# EAGLE schematic PhotoVideoFrame (EAGLE 9.6.2)

## Sheet 1 of 2
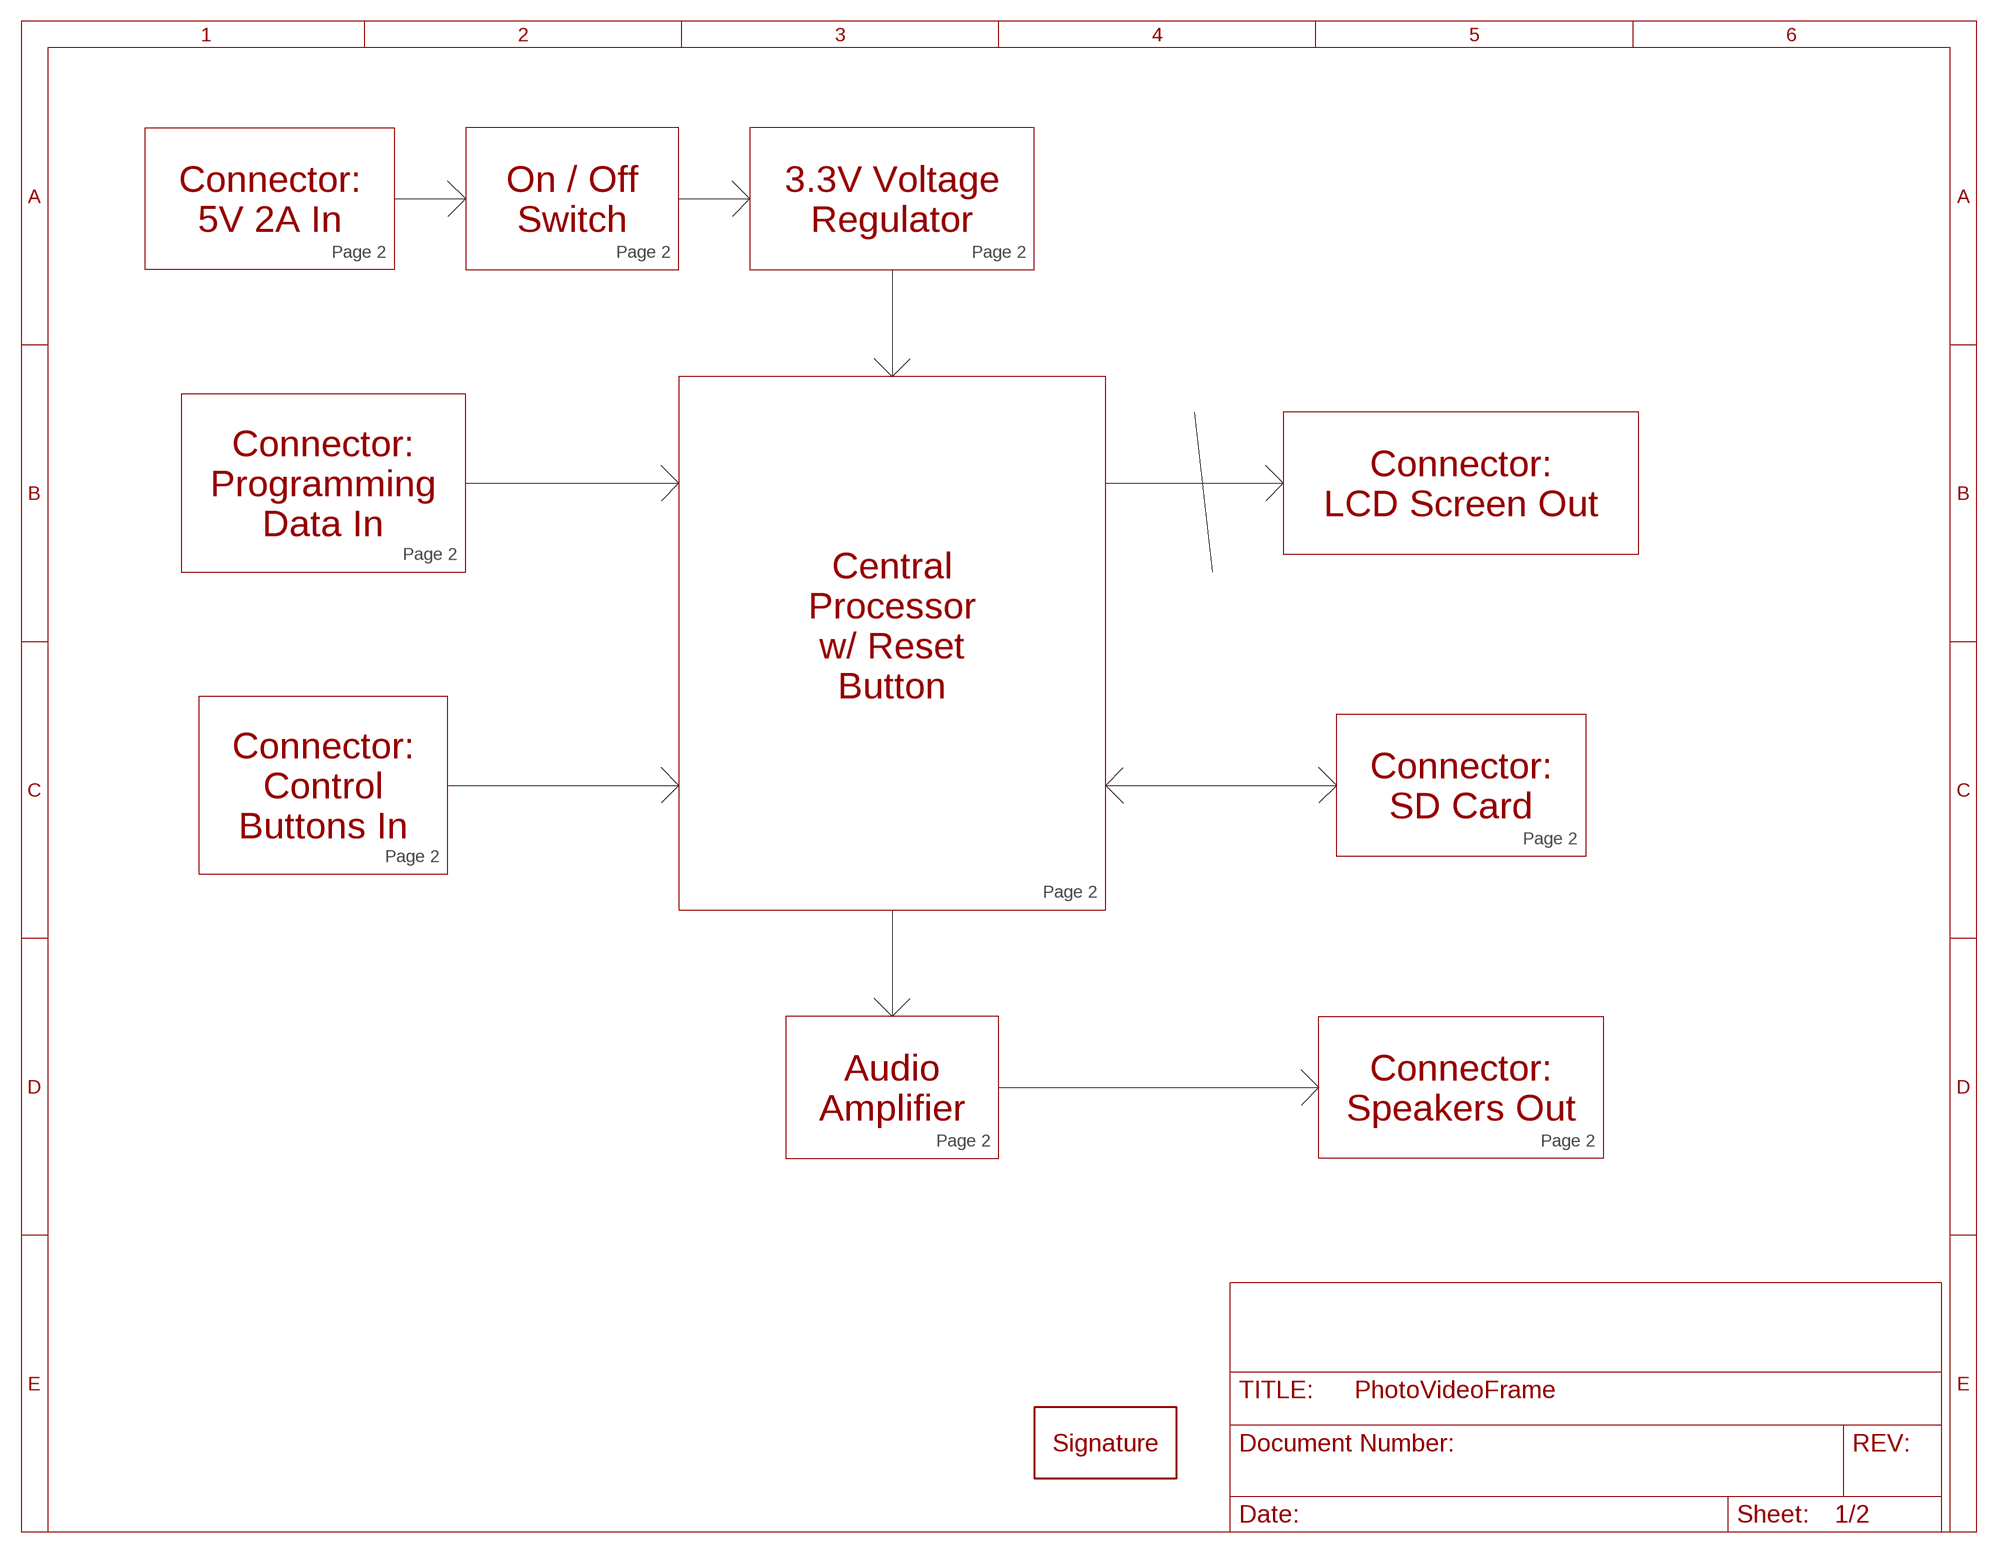
[diagram p0: schematic, sheet 1]

### Parts
U$1  SIGNATURE  [SIGNATURE]

### Notes on the sheet
- Connector:
  5V 2A In
- On / Off
  Switch
- 3.3V Voltage
  Regulator
- Page 2 | Page 2 | Page 2
- Connector:
  Programming
  Data In
- Connector:
  LCD Screen Out
- Page 2
- Central
  Processor
  w/ Reset
  Button
- Connector:
  Control
  Buttons In
- Connector:
  SD Card
- Page 2
- Page 2
- Page 2
- Audio
  Amplifier
- Connector:
  Speakers Out
- Page 2 | Page 2

## Sheet 2 of 2
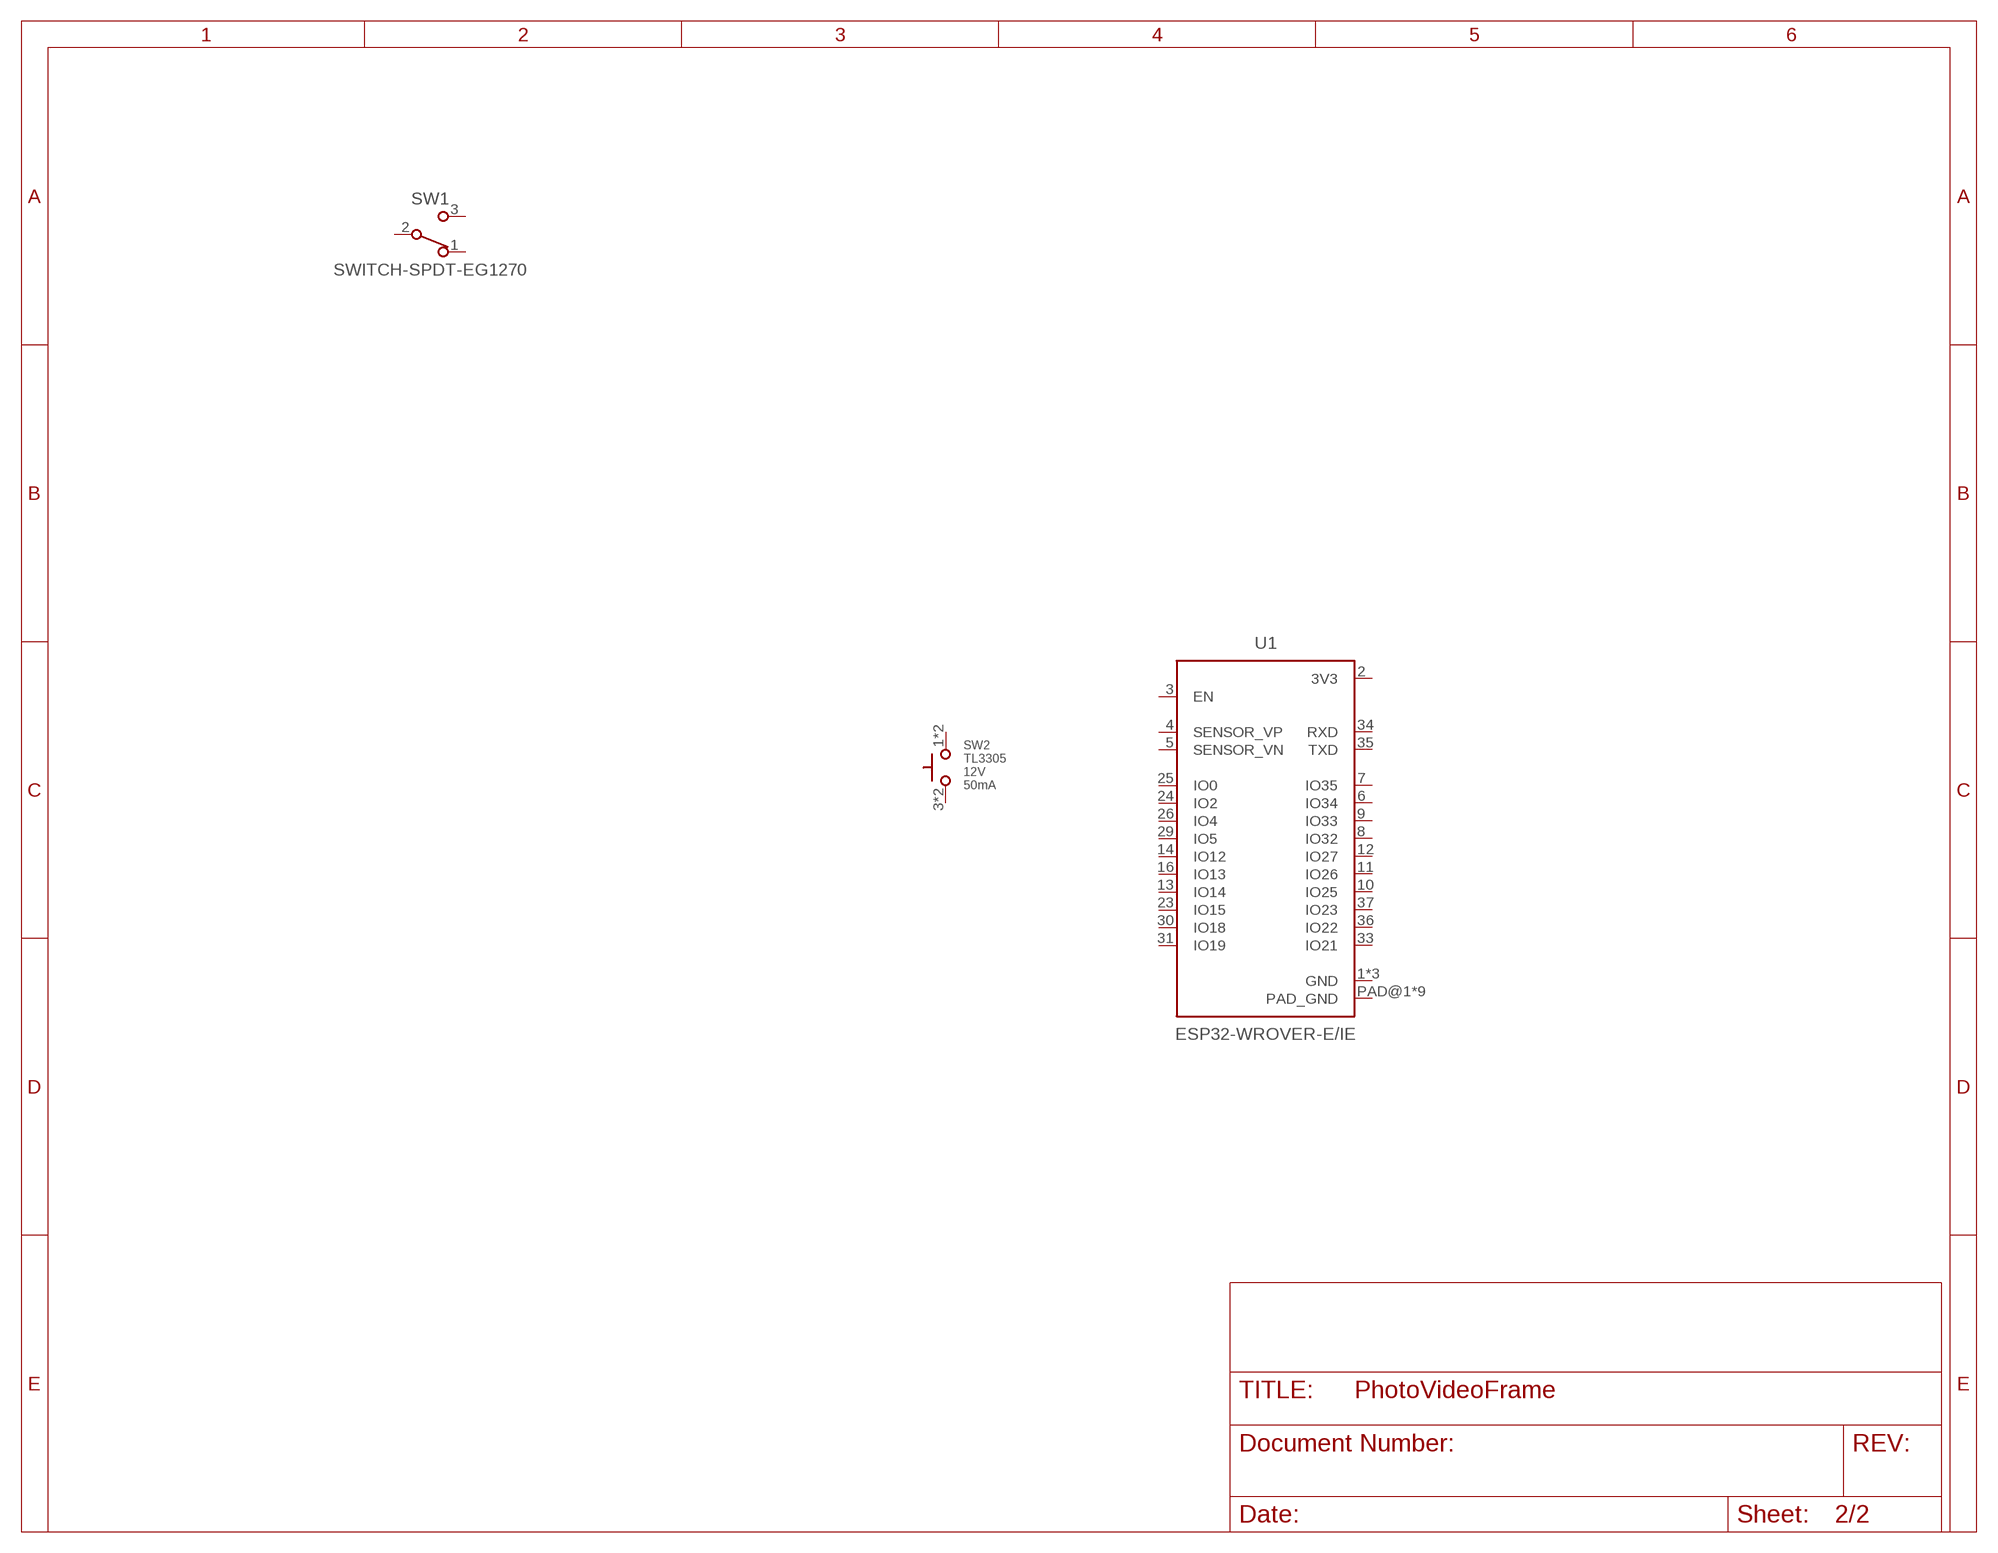
[diagram p1: schematic, sheet 2]

### Parts
SW1  SWITCH-SPDT-EG1270  [EG1270]
SW2  TL3305  BUTTON-V-SPST-TL3305  [TL3305]
U1  ESP32-WROVER-E/IE  [ESP32-WROVER-E/IE]
Unconnected: SW1.1 SW1.2(COMM) SW1.3 SW2.1 SW2.2 SW2.3 SW2.4 U1.1(GND) U1.2(3V3) U1.3(EN) U1.4(SENSOR_VP) U1.5(SENSOR_VN) U1.6(IO34) U1.7(IO35) U1.8(IO32) U1.9(IO33) U1.10(IO25) U1.11(IO26) U1.12(IO27) U1.13(IO14) U1.14(IO12) U1.15(GND) U1.16(IO13) U1.23(IO15) U1.24(IO2) U1.25(IO0) U1.26(IO4) U1.29(IO5) U1.30(IO18) U1.31(IO19) U1.33(IO21) U1.34(RXD) U1.35(TXD) U1.36(IO22) U1.37(IO23) U1.38(GND) U1.PAD@1(PAD_GND) U1.PAD@2(PAD_GND) U1.PAD@3(PAD_GND) U1.PAD@4(PAD_GND) U1.PAD@5(PAD_GND) U1.PAD@6(PAD_GND) U1.PAD@7(PAD_GND) U1.PAD@8(PAD_GND) U1.PAD@9(PAD_GND)

## Library data of the parts
SW1 = Harrington-Switches:SWITCH-SPDT: SPDT Switch E-Switch
SW2 = Harrington-Switches:BUTTON-V-SPST: SPST Button E-Switch - Vertical; I_MAX: 50mA; V_MAX: 12V
U1 = Harrington-ICs:ESP32-WROVER-E/IE: ESP32-WROVER-E/IE Espressif - ESP32 with 8MB PSRAM
U$1 = Harrington-Aesthetics:SIGNATURE: PCB Signature